# Altium schematic sheet diagrama_interior.SchDoc
size 127 x 101 mm; PageSetup: Record=PageOptions|CenterHorizontal=True|CenterVertical=True|PrintScale=1.05|XCorrection=1.00|YCorrection=1.00|PrintKind=0|BorderSize=5000000|LeftOffset=0|BottomOffset=0|Orientation=2|PaperLength=1000|PaperWidth=1000|Scale=100|PaperSource=7|PrintQuality=-4|MediaType=1|DitherType=10|PaperKind=A4 (8.2 x 11.7 in; 210 x 297 mm)|PrintScaleMode=1
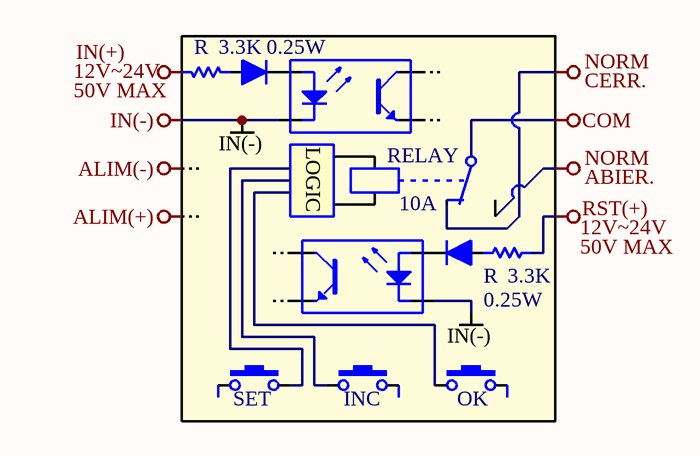
[diagram p0: diagrama_interior.SchDoc]

## Parts
(Parts that share a designator on the sheet are numbered #1, #2 ... from top to bottom, then left to right.)
D7#1  1N4007  [DIODE300_1MM]  (value not drawn)
D7#2  1N4007  [DIODE300_1MM]  (value not drawn)
INC  SW_T_GRAFICO  [SW_T_12X12_7.5MM_4P]  (value not drawn)
K?  Codigo Elemon: 10A  Dolares Elemon: RELAY  [relay2]  (hidden comment: SRD-12VDC-SLC)
OK  SW_T_GRAFICO  [SW_T_12X12_7.5MM_4P]  (value not drawn)
R9#1  Dolares Elemon: 0.25W  Codigo Elemon: R  Resistencia: 3.3K  [R1206]  (hidden comment: Resistencia 1206; 3.3Kohm)
R9#2  Dolares Elemon: 0.25W  Codigo Elemon: R  Resistencia: 3.3K  [R1206]  (hidden comment: Resistencia 1206; 3.3Kohm)
SET  SW_T_GRAFICO  [SW_T_12X12_7.5MM_4P]  (value not drawn)
U3#1  PC817  [DIP4]  (value not drawn)
U3#2  PC817  [DIP4]  (value not drawn)

## Nets
COM: K?.1
IN(-): U3#1.2(K)
NetR9#1_2: R9#1.2 R9#2.2
NetD7#1_1: D7#1.1 R9#1.1
NetD7#1_2: D7#1.2 U3#1.1(A)
NetD7#2_1: D7#2.1 R9#2.1
NetD7#2_2: D7#2.2 U3#2.1(A)

Not connected (* = marked no-connect by the designer): INC 3 4; K? 2 3 4 5; OK 3 4; SET 3 4; U3#1 3(E) 4(C); U3#2 2(K) 3(E) 4(C)

## Notes on the sheet
- (near U3#1) IN(-)
- (near U3#1) LOGIC
- IN(-)
- Labels drawn without touching a wire or pin: 12V~24V, 50V MAX, ABIER., ALIM(+), ALIM(-), CERR., IN(+), NORM, RST(+)

## Library data of the parts
D7#1 D7#2 = 1N4007: Codigo Elemon: DI1152060; Dolares Elemon: 0.01989
INC OK SET = SW_T_GRAFICO: SW_T_12X12MM; Price: ?
K? = Relay 12V; 1 Inversor
U3#1 U3#2 = PC817: Codigo Elemon: OP1696350; Dolares Elemon: 0.20398